# Altium project Expansion board.PrjPcb
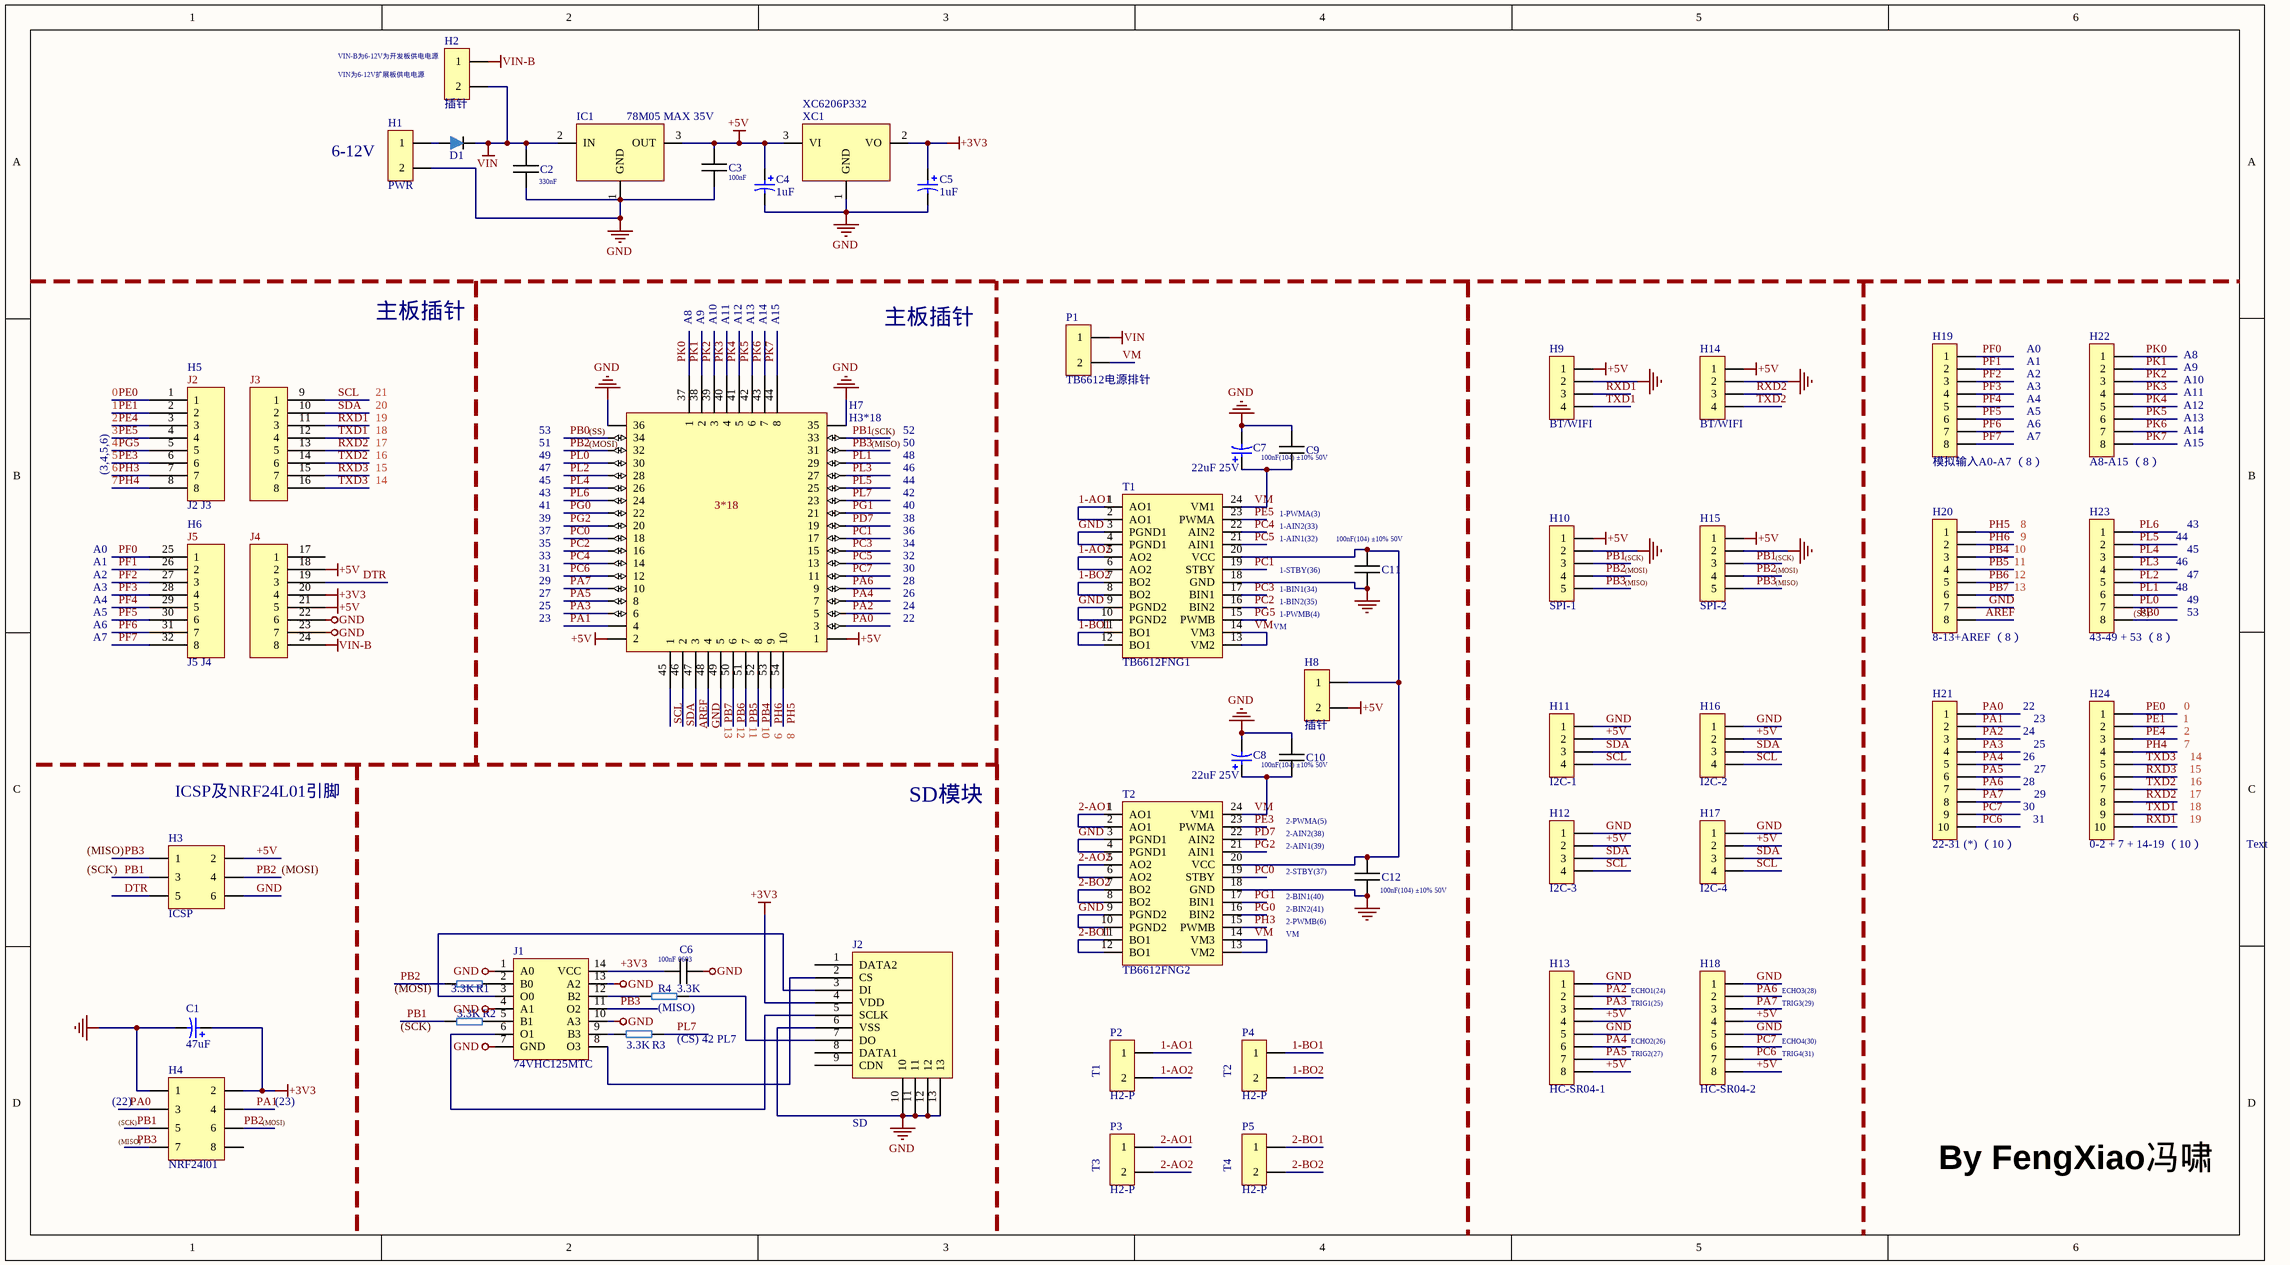
[diagram p0: Expansion board.SchDoc]
1 sheet, 52 parts. Net scope: global (net labels, ports and power ports of the same name join across sheets).
Board file: Expansion board.PcbDoc

## Sheet Expansion board.SchDoc
size 457 x 254 mm; DrawnBy: 冯啸

### Parts
C1  47uF  [极性电容]
C2  330nF  [0805]
C3  100nF  [0805]
C4  1uF  [0603]
C5  1uF  [0603]
C6  100nF 0603  [0603]
C7  22uF 25V  [极性电容]
C8  22uF 25V  [极性电容]
C9  100nF(104) ±10% 50V  [0805]
C10  100nF(104) ±10% 50V  [0805]
C11  100nF(104) ±10% 50V  [0805]
C12  100nF(104) ±10% 50V  [0805]
D1  二极管  [1206 +-]  (value not drawn)
H1  PWR  [插线端子2P]
H2  插针  [H2]
H3  ICSP  [H2*3]
H4  NRF24l01  [H2*4]
H5  J2 J3  [J2J3]
H6  J5 J4  [J5J4]
H7  H3*18  [H3*18]
H8  插针  [H2]
H9  BT/WIFI  [H4]
H10  SPI-1  [H5]
H11  I2C-1  [H4]
H12  I2C-3  [H4]
H13  HC-SR04-1  [H8]
H14  BT/WIFI  [H4]
H15  SPI-2  [H5]
H16  I2C-2  [H4]
H17  I2C-4  [H4]
H18  HC-SR04-2  [H8]
H19  模拟输入A0-A7 （8）  [H8]
H20  8-13+AREF （8）  [H8]
H21  22-31 (*) （10）  [H10]
H22  A8-A15 （8）  [H8]
H23  43-49 + 53 （8）  [H8]
H24  0-2 + 7 + 14-19 （10）  [H10]
IC1  78M05 MAX 35V  [78M05]
J1  74VHC125MTC  [74VHC125MTC]
J2  SD  [SD]
P1  TB6612电源排针  [H2]
P2  H2-P  [插线端子2P]
P3  H2-P  [插线端子2P]
P4  H2-P  [插线端子2P]
P5  H2-P  [插线端子2P]
R1  3.3K  [0805]
R2  3.3K  [0805]
R3  3.3K  [0805]
R4  3.3K  [0805]
T1  TB6612FNG1  [TB6612GNG]
T2  TB6612FNG2  [TB6612GNG]
XC1  XC6206P332  [XC6206P332-3.3v]

### Nets
+3V3: C1.1 C5.1 C6.1 H4.2 H6.20(4) J1.14(VCC) J2.4(VDD) XC1.2(VO)
+5V: C3.2 C4.1 H3.2 H6.18(2) H6.21(5) H7.1 H7.2 H8.2 H9.1 H10.1 H11.2 H12.2 H13.4 H13.8 H14.1 H15.1 H16.2 H17.2 H18.4 H18.8 IC1.3(OUT) XC1.3(VI)
GND: C1.2 C2.1 C3.1 C4.2 C5.2 C6.2 C7.2 C8.2 C9.2 C10.2 C11.1 C12.1 H1.2 H3.6 H4.1 H6.22(6) H6.23(7) H7.35 H7.36 H7.48(4) H9.2 H10.2 H11.1 H12.1 H13.1 H13.5 H14.2 H15.2 H16.1 H17.1 H18.1 H18.5 H20.7 IC1.1(GND) J1.1(A0) J1.4(A1) J1.7(GND) J1.10(A3) J1.13(A2) J2.6(VSS) J2.10 J2.11 J2.12 J2.13 T1.3(PGND1) T1.4(PGND1) T1.9(PGND2) T1.10(PGND2) T1.18(GND) T2.3(PGND1) T2.4(PGND1) T2.9(PGND2) T2.10(PGND2) T2.18(GND) XC1.1(GND)
VIN: C2.2 D1.2 H2.2 IC1.2(IN) P1.1
VIN-B: H2.1 H6.24(8)
1-AO1: P2.1 T1.1(AO1) T1.2(AO1)
1-AO2: P2.2 T1.5(AO2) T1.6(AO2)
1-BO1: P4.1 T1.11(BO1) T1.12(BO1)
1-BO2: P4.2 T1.7(BO2) T1.8(BO2)
2-AO1: P3.1 T2.1(AO1) T2.2(AO1)
2-AO2: P3.2 T2.5(AO2) T2.6(AO2)
2-BO1: P5.1 T2.11(BO1) T2.12(BO1)
2-BO2: P5.2 T2.7(BO2) T2.8(BO2)
AREF: H7.47(3) H20.8
DTR: H3.5 H6.19(3)
PA0: H4.3 H7.3 H21.1
PA1: H4.4 H7.4 H21.2
PA2: H7.5 H13.2 H21.3
PA3: H7.6 H13.3 H21.4
PA4: H7.7 H13.6 H21.5
PA5: H7.8 H13.7 H21.6
PA6: H7.9 H18.2 H21.7
PA7: H7.10 H18.3 H21.8
PB0: H7.34 H23.8
PB1: H3.3 H4.5 H7.33 H10.3 H15.3 R2.1
PB2: H3.4 H4.6 H7.32 H10.4 H15.4 R1.1
PB3: H3.1 H4.7 H7.31 H10.5 H15.5 J1.11(O2)
PB4: H7.52(8) H20.3
PB5: H7.51(7) H20.4
PB6: H7.50(6) H20.5
PB7: H7.49(5) H20.6
PC0: H7.18 T2.19(STBY)
PC1: H7.17 T1.19(STBY)
PC2: H7.16 T1.16(BIN2)
PC3: H7.15 T1.17(BIN1)
PC4: H7.14 T1.22(AIN2)
PC5: H7.13 T1.21(AIN1)
PC6: H7.12 H18.7 H21.10
PC7: H7.11 H18.6 H21.9
PD7: H7.19 T2.22(AIN2)
PE0: H5.1 H24.1
PE1: H5.2 H24.2
PE3: H5.6 T2.23(PWMA)
PE4: H5.3 H24.3
PE5: H5.4 T1.23(PWMA)
PF0: H6.25(1) H19.1
PF1: H6.26(2) H19.2
PF2: H6.27(3) H19.3
PF3: H6.28(4) H19.4
PF4: H6.29(5) H19.5
PF5: H6.30(6) H19.6
PF6: H6.31(7) H19.7
PF7: H6.32(8) H19.8
PG0: H7.22 T2.16(BIN2)
PG1: H7.21 T2.17(BIN1)
PG2: H7.20 T2.21(AIN1)
PG5: H5.5 T1.15(PWMB)
PH3: H5.7 T2.15(PWMB)
PH4: H5.8 H24.4
PH5: H7.54(10) H20.1
PH6: H7.53(9) H20.2
PK0: H7.37(1) H22.1
PK1: H7.38(2) H22.2
PK2: H7.39(3) H22.3
PK3: H7.40(4) H22.4
PK4: H7.41(5) H22.5
PK5: H7.42(6) H22.6
PK6: H7.43(7) H22.7
PK7: H7.44(8) H22.8
PL0: H7.30 H23.7
PL1: H7.29 H23.6
PL2: H7.28 H23.5
PL3: H7.27 H23.4
PL4: H7.26 H23.3
PL5: H7.25 H23.2
PL6: H7.24 H23.1
PL7: H7.23 R3.2
RXD1: H5.11(3) H9.3 H24.10
RXD2: H5.13(5) H14.3 H24.8
RXD3: H5.15(7) H24.6
SCL: H5.9(1) H7.45(1) H11.4 H12.4 H16.4 H17.4
SDA: H5.10(2) H7.46(2) H11.3 H12.3 H16.3 H17.3
TXD1: H5.12(4) H9.4 H24.9
TXD2: H5.14(6) H14.4 H24.7
TXD3: H5.16(8) H24.5
VM: C7.1 C8.1 C9.1 C10.1 P1.2 T1.13(VM2) T1.14(VM3) T1.24(VM1) T2.13(VM2) T2.14(VM3) T2.24(VM1)
NetC11_2: C11.2 C12.2 H8.1 T1.20(VCC) T2.20(VCC)
NetD1_1: D1.1 H1.1
NetJ1_2: J1.2(B0) R1.2
NetJ1_3: J1.3(O0) J2.3(DI)
NetJ1_5: J1.5(B1) R2.2
NetJ1_6: J1.6(O1) J2.5(SCLK)
NetJ1_8: J1.8(O3) J2.2(CS)
NetJ1_9: J1.9(B3) R3.1
NetJ1_12: J1.12(B2) R4.1
NetJ2_7: J2.7(DO) R4.2

Not connected (* = marked no-connect by the designer): H4 8; H6 17(1); J2 1(DATA2) 8(DATA1) 9(CDN)

### Notes on the sheet
- VIN-B为6-12V为开发板供电电源
- VIN为6-12V扩展板供电电源
- (near H1) 6-12V
- 主板插针
- A8
- A9
- A10
- A11
- A12
- A13
- A14
- A15
- 0
- 1
- 21
- 20
- A0
- A1
- A2
- A3
- A4
- 2
- 3
- 4
- 5
- 19
- 18
- 17
- 16
- 49
- 51
- 53
- (near H7) (SS)
- (near H7) (MOSI)
- (near H7) (SCK)
- (near H7) (MISO)
- 48
- 50
- 52
- A5
- A6
- A7
- 6
- 7
- (3,4,5,6)
- 15
- 14
- 37
- 39
- 41
- 43
- 45
- 47
- 36
- 38
- 40
- 42
- 44
- 46
- 1-PWMA(3)
- 1-AIN2(33)
- 8
- 29
- 31
- 33
- 35
- 28
- 30
- 32
- 34
- 1-AIN1(32)
- 1-STBY(36)
- 1-BIN1(34)
- (SCK)
- (MOSI)
- (MISO)
- 10
- 11
- 12
- 13
- 9
- 23
- 25
- 27
- 22
- 24
- 26
- VM
- 1-BIN2(35)
- 1-PWMB(4)
- (near H23) (SS)
- ICSP及NRF24L01引脚
- SD模块
- 2-PWMA(5)
- 2-AIN2(38)
- (near H3) (MISO)
- 2-AIN1(39)
- 2-STBY(37)
- 2-BIN1(40)
- 2-BIN2(41)
- Text
- 2-PWMB(6)
- (near R2) (SCK)
- (near R4) (MISO)
- ECHO1(24)
- TRIG1(25)
- ECHO3(28)
- TRIG3(29)
- (CS) 42 PL7
- (near P2) T1
- (near P4) T2
- ECHO2(26)
- TRIG2(27)
- ECHO4(30)
- TRIG4(31)
- (near H4) (22)
- (near H4) (MISO)
- (near H4) (SCK)
- (near H4) (MOSI)
- (23)
- (near P3) T3
- (near P5) T4
- By FengXiao冯啸
- (in symbol H3*18) 3*18
- (in symbol J2-3) J2; J3
- (in symbol J5-4) J5; J4

### Library data of the parts
C1 C7 C8 = Cap Pol极性电容: 极性电容器; Published: 8-Jun-2000; LatestRevisionDate: 17-Jul-2002; LatestRevisionNote: Re-released for DXP Platform.; PackageReference: RB7.6-15; Publisher: Altium Limited; PackageDescription: Polarized Capacitor (Radial); 2 Leads
C2 C3 C6 = CAP-N
C4 C5 = Cap: 极性电容器; Published: 8-Jun-2000; LatestRevisionDate: 17-Jul-2002; LatestRevisionNote: Re-released for DXP Platform.; PackageReference: RB7.6-15; Publisher: Altium Limited; PackageDescription: Polarized Capacitor (Radial); 2 Leads
C9-C12 = CAP-0805
H1 = H2
H2 H8 = H2: 排针类
H3 = H3*2
H4 = Header 2*4
H5 = J2-3
H6 = J5-4
H9 H11 H12 H14 H16 H17 = H4
H10 H15 = H5
H13 H18-H20 H22 H23 = H8
H21 H24 = H10
IC1 = 78M05-5.0V: MAX 18V
J1 = 74VHC125MCT
P1-P5 = H2-P: 排管类
R1-R4 = RES
T1 T2 = TB6612
XC1 = XC6206P332: 3.3V限性稳压器